# EAGLE design ledupper (EAGLE 7.1.0)
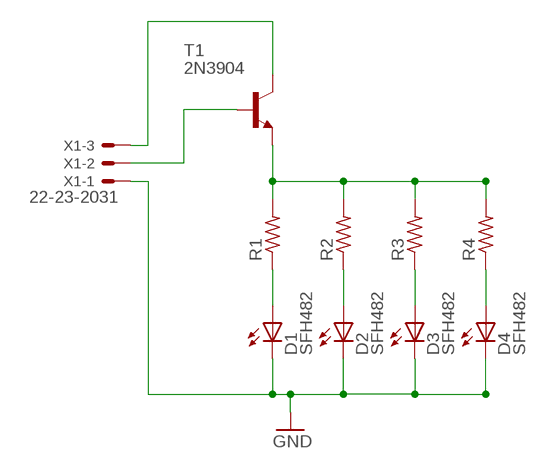
[diagram p0: schematic, sheet 1]

## Parts
D1  SFH482  [SFH482]
D2  SFH482  [SFH482]
D3  SFH482  [SFH482]
D4  SFH482  [SFH482]
R1  R-US_0204/7  [0204/7]
R2  R-US_0204/7  [0204/7]
R3  R-US_0204/7  [0204/7]
R4  R-US_0204/7  [0204/7]
T1  2N3904  [TO92]
X1  22-23-2031  [22-23-2031]

## Nets
GND: D1.K(C) D2.K(C) D3.K(C) D4.K(C) X1.1
N$1: T1.1(C) X1.3
N$2: T1.2(B) X1.2
N$4: D1.A R1.1
N$5: D2.A R2.1
N$6: D3.A R3.1
N$7: D4.A R4.1
N$8: R1.2 R2.2 R3.2 R4.2 T1.3(E)

## Library data of the parts
D1-D4 = led:SFH482: IR LED infrared emitting diode, Infineon
R1-R4 = rcl:R-US_: RESISTOR, American symbol
T1 = transistor:2N3904: NPN TRANSISTOR
X1 = con-molex:22-23-2031: .100" (2.54mm) Center Header - 3 Pin; MF: MOLEX; MPN: 22-23-2031; OC_FARNELL: 1462950; OC_NEWARK: 30C0862

## Board
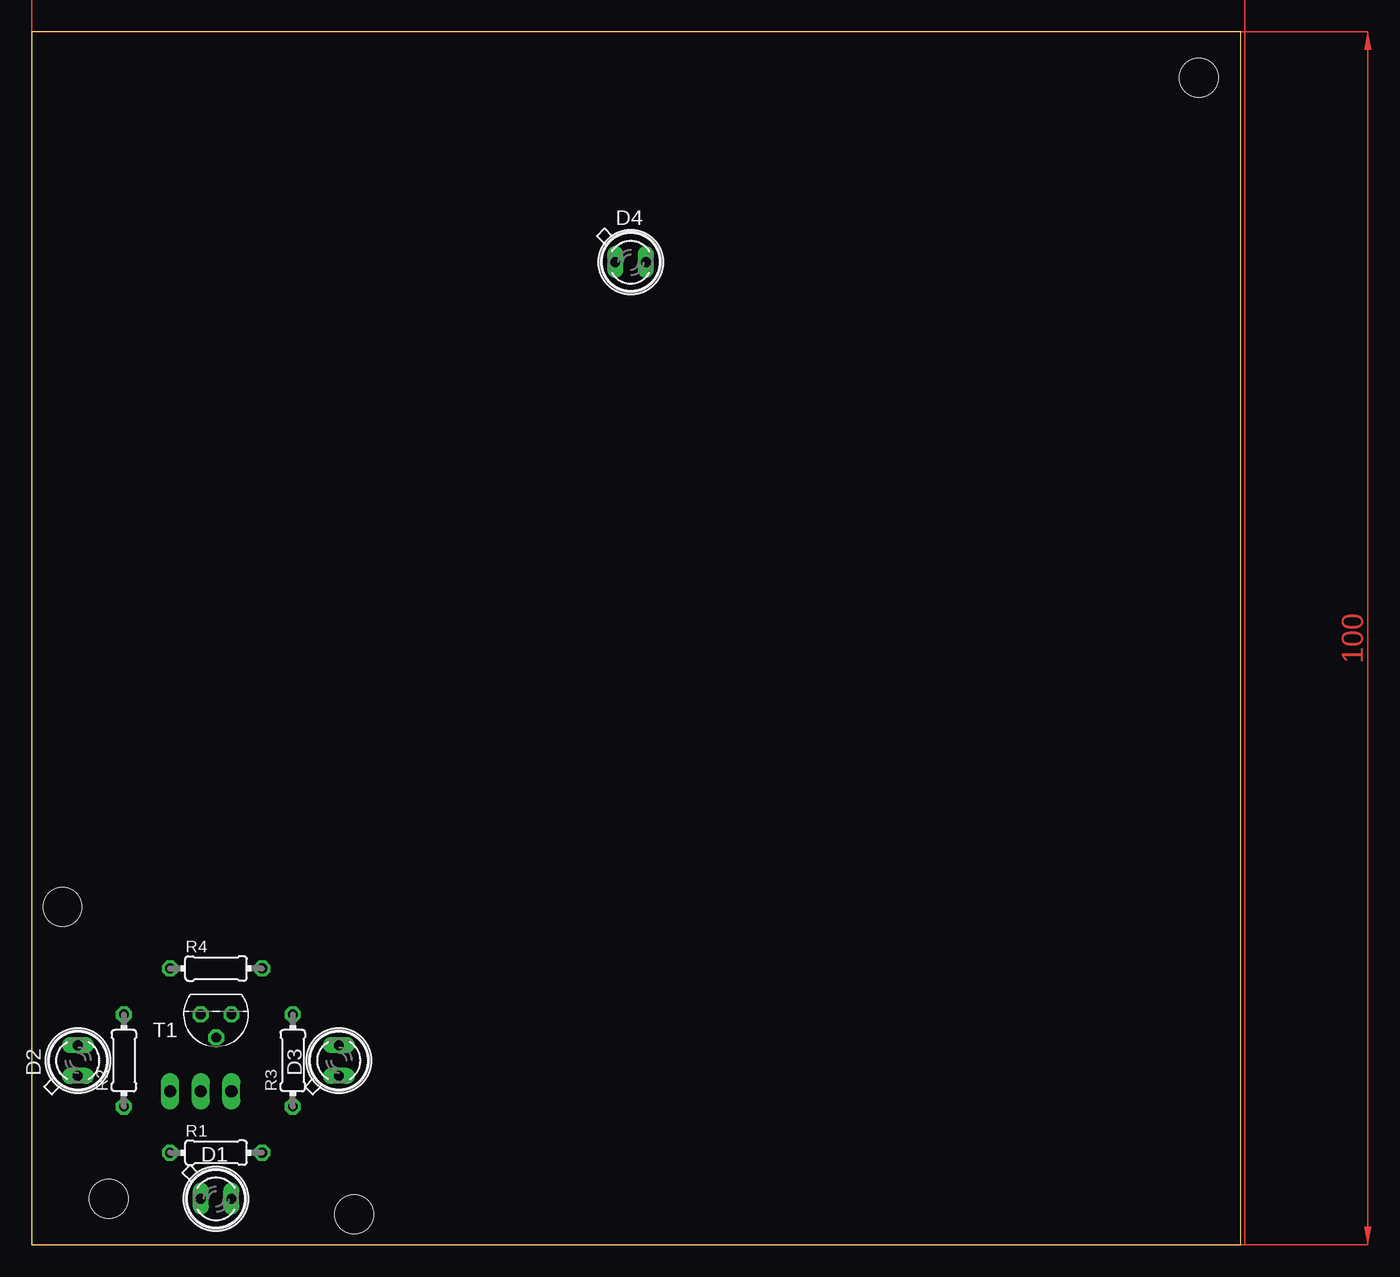
[diagram p1: board, top side]
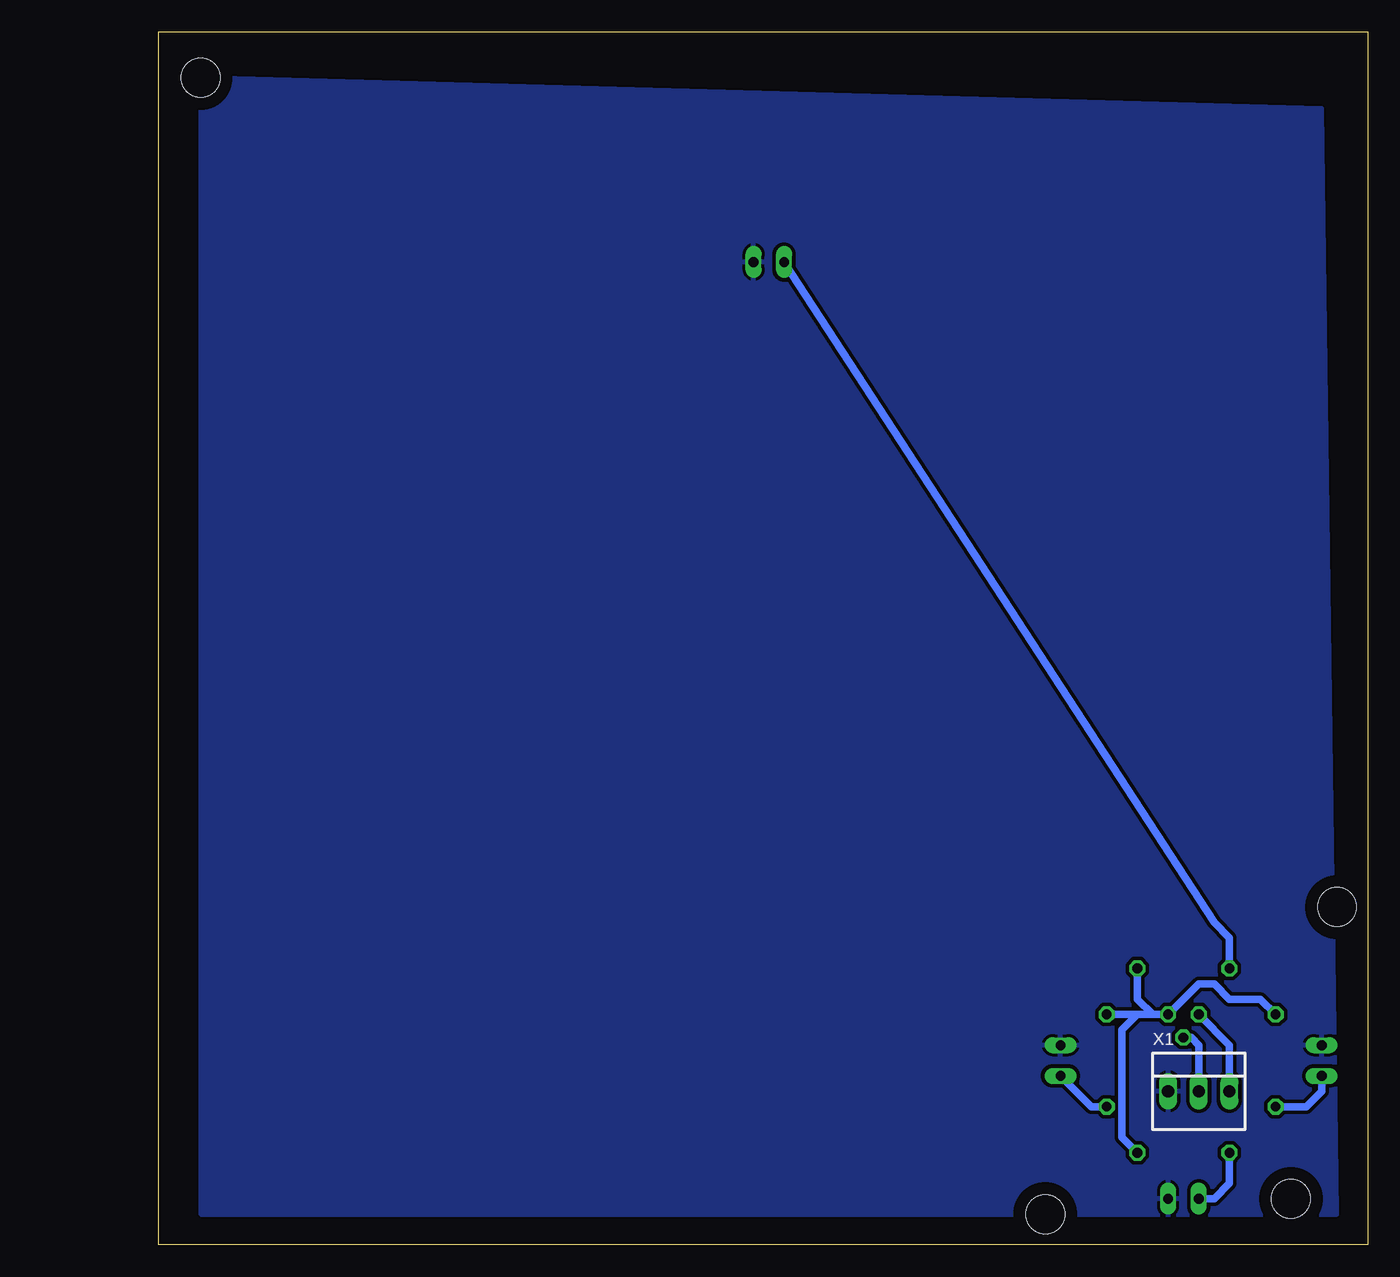
[diagram p2: board, bottom side, seen from below]

Size 100 x 100.32 mm. Coordinates in mm from the lower left corner, seen from the top.
Outline: 0,0 100,0 100,100.32 0,100.32 0,0
Copper layers (1*16): Top 0.035mm / dielectric 1.5mm / Bottom 0.035mm
Design rules "default": minimum track width 10mil, minimum drill 24mil, track to track 8mil, track to pad 8mil, pad to pad 8mil, via to via 8mil, smd to smd 8mil, copper to edge 40mil, drill to drill 8mil, minimum pad ring 10mil, minimum via ring 8mil, stop-mask expansion 4mil, vias tented up to drill 0mil, thermal gap 10mil
Holes 3.2 mm at 2.54,27.94 96.52,96.52 26.67,2.54 6.35,3.81

### Footprints (pad centres in the part's own frame; a part is rotated, then mirrored left to right if it is on the bottom)
SFH482 = drill 0.813 long: A -1.27,0; K 1.27,0
0204/7 = drill 0.813 octagon: 1 -3.81,0; 2 3.81,0
TO92 = drill 0.813 octagon: 1 1.27,0; 2 0,1.905; 3 -1.27,0
22-23-2031 = drill 1 long: 1 -2.54,0; 2 0,0; 3 2.54,0

### Placement (x,y rotation side)
D1  15.24,3.81 0 top
D2  3.81,15.24 90 top
D3  25.4,15.24 90 top
D4  49.53,81.28 0 top
R1  15.24,7.62 0 top
R2  7.62,15.24 90 top
R3  21.59,15.24 90 top
R4  15.24,22.86 0 top
T1  15.24,19.05 180 top
X1  13.97,12.7 0 bottom

### Tracks (layer width: path | path; a pad name or v marks a point on that pad's centre or on a via)
GND
  pour Bottom (isolate 0.305): 2.54,2.54 3.81,93.98 96.52,96.52 96.52,2.54
N$1
  Bottom 0.61: T1.1 11.43,16.51 X1.3
N$2
  Bottom 0.61: T1.2 14.61,17.14 13.97,16.51 X1.2
N$4
  Bottom 0.61: R1.1 11.43,5.08 12.7,3.81 D1.A
N$5
  Bottom 0.61: D2.A 3.81,12.7 5.08,11.43 R2.1
N$6
  Bottom 0.61: R3.1 22.86,11.43 D3.A
N$7
  Bottom 0.61: D4.A 12.7,26.67 11.43,25.4 R4.1
N$8
  Bottom 0.61: 17.78,19.05 T1.3 13.97,21.59 12.7,21.59 11.43,20.32 8.89,20.32 R2.2 | 17.78,19.05 19.05,19.05 | 19.05,19.05 R3.2 | R1.2 20.32,8.89 20.32,17.78 19.05,19.05 | R4.2 19.05,20.32 17.78,19.05
(copper drawn outside any net)
  shapes: Top area x2